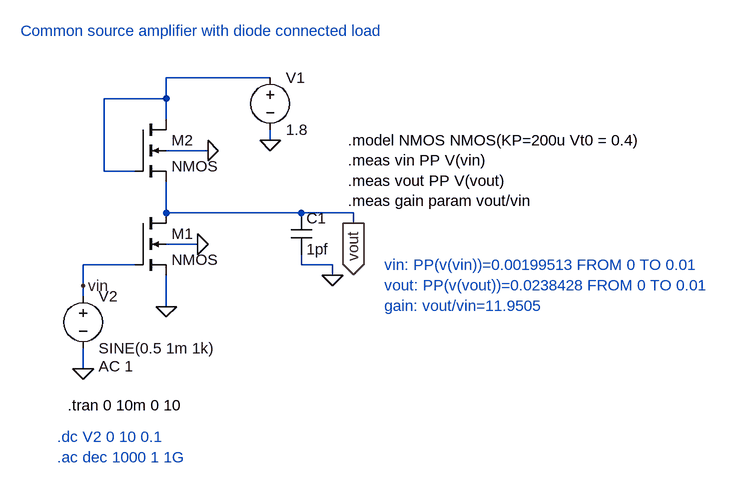
[diagram p0: schematic common_source_amp_NMOS_diode_src.asc]
common_source_amp_NMOS_diode_src.asc, the LTspice schematic file:
Version 4
SHEET 1 1308 680
WIRE 352 -48 192 -48
WIRE 192 -16 192 -48
WIRE 192 -16 96 -16
WIRE 192 16 192 -16
WIRE 352 48 352 32
WIRE 256 64 192 64
WIRE 96 96 96 -16
WIRE 144 96 96 96
WIRE 192 160 192 112
WIRE 400 160 192 160
WIRE 480 160 400 160
WIRE 480 176 480 160
WIRE 240 208 192 208
WIRE 144 240 64 240
WIRE 400 240 400 224
WIRE 448 240 400 240
WIRE 448 256 448 240
WIRE 64 272 64 240
WIRE 64 288 64 272
WIRE 192 304 192 256
WIRE 64 400 64 368
FLAG 192 304 0
FLAG 64 400 0
FLAG 256 64 0
FLAG 240 208 0
FLAG 352 48 0
FLAG 64 272 vin
FLAG 448 256 0
FLAG 480 176 vout
IOPIN 480 176 Out
SYMBOL nmos4 144 160 R0
SYMATTR InstName M1
SYMATTR Value2 l=1u w=144u
SYMBOL voltage 352 -64 R0
WINDOW 123 0 0 Left 0
WINDOW 39 0 0 Left 0
SYMATTR InstName V1
SYMATTR Value 1.8
SYMBOL voltage 64 272 R0
WINDOW 123 24 124 Left 2
WINDOW 39 0 0 Left 0
SYMATTR Value2 AC 1
SYMATTR InstName V2
SYMATTR Value SINE(0.5 1m 1k)
SYMBOL nmos4 144 16 R0
SYMATTR InstName M2
SYMATTR Value2 l=1u w=1u
SYMBOL cap 384 160 R0
SYMATTR InstName C1
SYMATTR Value 1pf
TEXT 472 48 Left 2 !.model NMOS NMOS(KP=200u Vt0 = 0.4)\n.meas vin PP V(vin)\n.meas vout PP V(vout)\n.meas gain param vout/vin
TEXT -32 -120 Left 2 ;Common source amplifier with diode connected load
TEXT 40 456 Left 2 !.tran 0 10m 0 10
TEXT 528 240 Left 2 ;vin: PP(v(vin))=0.00199513 FROM 0 TO 0.01\nvout: PP(v(vout))=0.0238428 FROM 0 TO 0.01\ngain: vout/vin=11.9505
TEXT 24 504 Left 2 ;.dc V2 0 10 0.1
TEXT 24 536 Left 2 ;.ac dec 1000 1 1G

The netlist it stands for:
* common_source_amp_NMOS_diode_src.asc
M1 vout vin 0 0 NMOS l=1u w=144u
V1 N001 0 1.8
V2 vin 0 SINE(0.5 1m 1k) AC 1
M2 N001 N001 vout 0 NMOS l=1u w=1u
C1 vout 0 1pf
.model NMOS NMOS
.model PMOS PMOS
.lib standard.mos
.model NMOS NMOS(KP=200u Vt0 = 0.4)
.meas vin PP V(vin)
.meas vout PP V(vout)
.meas gain param vout/vin
* Common source amplifier with diode connected load
.tran 0 10m 0 10
* vin: PP(v(vin))=0.00199513 FROM 0 TO 0.01
* vout: PP(v(vout))=0.0238428 FROM 0 TO 0.01
* gain: vout/vin=11.9505
* .dc V2 0 10 0.1
* .ac dec 1000 1 1G
.backanno
.end